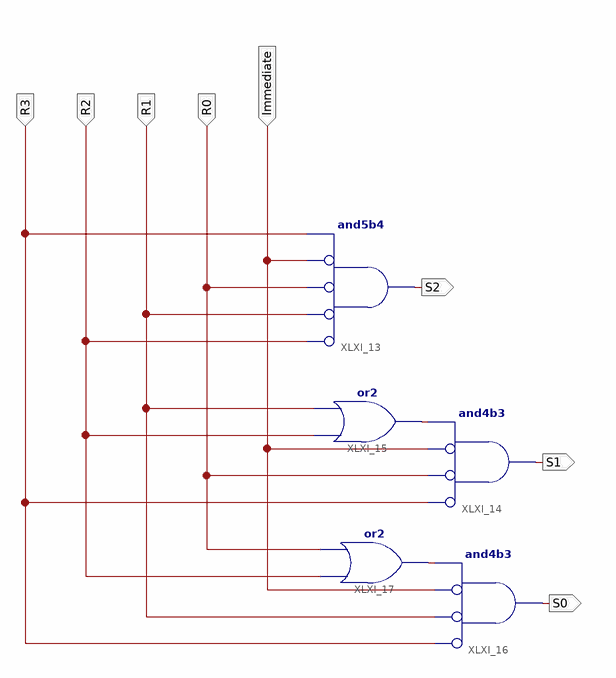
[diagram p0: schematic sheet 1]
// Xilinx ISE schematic ALU_Decoder.sch (spartan3e) as structural Verilog: 5 symbols, 8 ports
module ALU_Decoder (
  input  Immediate,
  input  R0,
  input  R1,
  input  R2,
  input  R3,
  output S2,
  output S1,
  output S0
);

  wire XLXN_41, XLXN_46;

  and XLXI_13 (S2, ~R2, ~R1, ~R0, ~Immediate, R3);  // and5b4
  or XLXI_15 (XLXN_41, R2, R1);
  and XLXI_14 (S1, ~R3, ~R0, ~Immediate, XLXN_41);  // and4b3
  or XLXI_17 (XLXN_46, R2, R0);
  and XLXI_16 (S0, ~R3, ~R1, ~Immediate, XLXN_46);  // and4b3
endmodule
